# Altium schematic sheet Storage.SchDoc
size A4
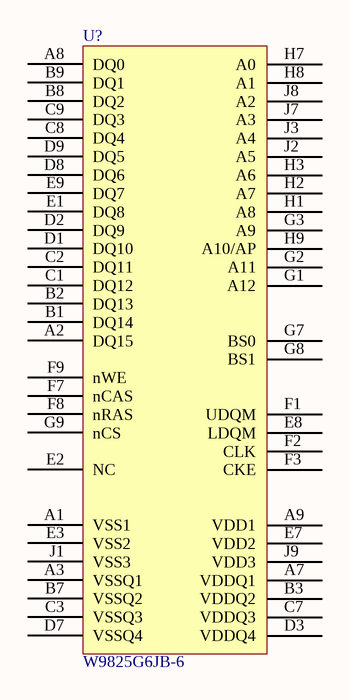
[diagram p0: Storage.SchDoc]

## Parts
U?  W9825G6JB-6  [TFBGA-54]

## Nets

Not connected (* = marked no-connect by the designer): U? A1(VSS1) A2(DQ15) A3(VSSQ1) A7(VDDQ1) A8(DQ0) A9(VDD1) B1(DQ14) B2(DQ13) B3(VDDQ2) B7(VSSQ2) B8(DQ2) B9(DQ1) C1(DQ12) C2(DQ11) C3(VSSQ3) C7(VDDQ3) C8(DQ4) C9(DQ3) D1(DQ10) D2(DQ9) D3(VDDQ4) D7(VSSQ4) D8(DQ6) D9(DQ5) E1(DQ8) E2(NC) E3(VSS2) E7(VDD2) E8(LDQM) E9(DQ7) F1(UDQM) F2(CLK) F3(CKE) F7(nCAS) F8(nRAS) F9(nWE) G1(A12) G2(A11) G3(A9) G7(BS0) G8(BS1) G9(nCS) H1(A8) H2(A7) H3(A6) H7(A0) H8(A1) H9(A10/AP) J1(VSS3) J2(A5) J3(A4) J7(A3) J8(A2) J9(VDD3)